# EasyEDA Pro project ProPrj_HEMY 2.0_2025-04-23.epro, board PCB5_1
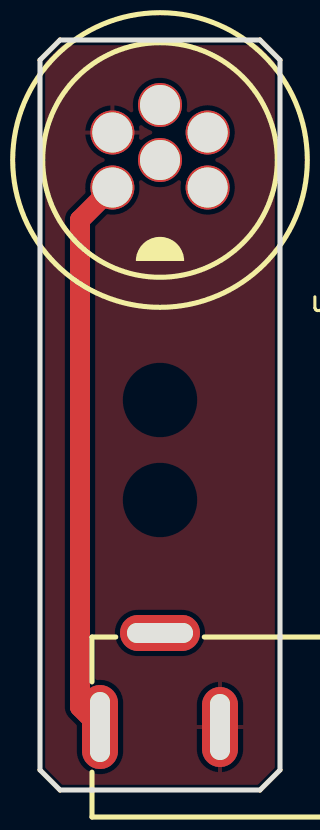
[diagram p14: board, top side]
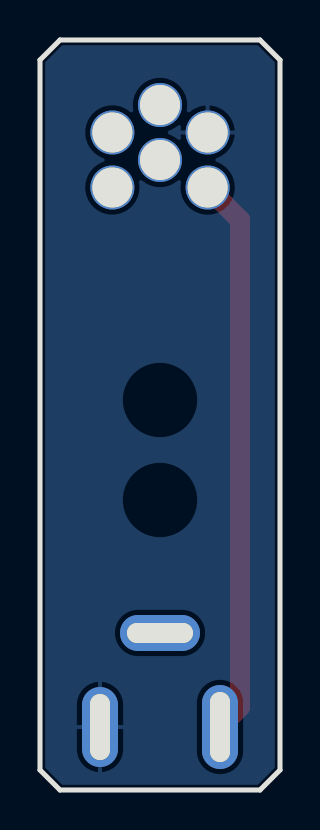
[diagram p15: board, bottom side, seen from below]

Outline 12 x 37.5 mm; copper layers: Top Layer, Bottom Layer. Coordinates in mm from the lower left corner of the outline.
Outline path: 0,36.5 0,1 1,0 11,0 12,1 12,36.5 11,37.5 1,37.5 0,36.5
Stack: Top Layer 0.035mm / Dielectric1 1.51mm FR4 er 4.5 / Bottom Layer 0.035mm

## Design rules (mm)
template: JLCPCB Capability(Two Layers Board)
spacing copperThickness1oz (default): track to track 0.102, other pairs 0.152 to 0.3
spacing copperThickness2oz: track to track 0.203, other pairs 0.152 to 0.3
track width copperThickness1oz (default): min 0.127, default 0.254, max 2.54
track width copperThickness2oz: min 0.203, default 0.254, max 2.54
differential pair differentialPair (default): width min 0.127, default 0.254, max 2.54; gap min 0.152, default 0.152
via viaSize (default): diameter min 0.5, default 0.61, max 10; hole min 0.3, default 0.305, max 6.3

## Placement (name value [footprint] x y rotation side)
DC1  DC-005-5A-2.0  [DC-IN-TH_DC-005-5A-2.0]  6 5.5 180 top
U1  KH-GX12-6P  [CONN-TH_GX12-6P]  6 32.19 180 top

## Footprints (pads in the part's own frame, mm; a bottom-side part is the same pattern mirrored in y, then rotated)
CONN-TH_GX12-6P
  round 2.2 hole 2x1.6: 1(2.381,2.062) 2(2.381,-0.688) 3(0,-2.062) 4(-2.381,-0.688) 5(-2.381,2.062) 6(0,0.688)
DC-IN-TH_DC-005-5A-2.0
  oval 1.8x4.2 hole 1x3.5: 1(3,2.352)
  oval 1.8x4 hole 1x3.3: 2(-3,2.352)
  oval 4x1.8 hole 3.3x1: 3(-0.001,-2.352)

## Nets
As in the schematic.

Pads without a net: DC1 3

## Routing (per net, layer and track width the routed paths; a pad name or vN(x,y) marks a point on that pad's centre or on a via; arc(x,y) is an arc through that point)
$1N564: length 28.1
  Top Layer w1: U1.1 2,28.51 2,4.15 DC1.1

## Copper pours and planes (outline as drawn; the poured copper is in the pictures)
GND on Top Layer: -29.31,47.88 37.12,47.88 37.12,-5.33 -29.31,-5.33
GND on Bottom Layer: -29.31,47.88 37.12,47.88 37.12,-5.33 -29.31,-5.33
